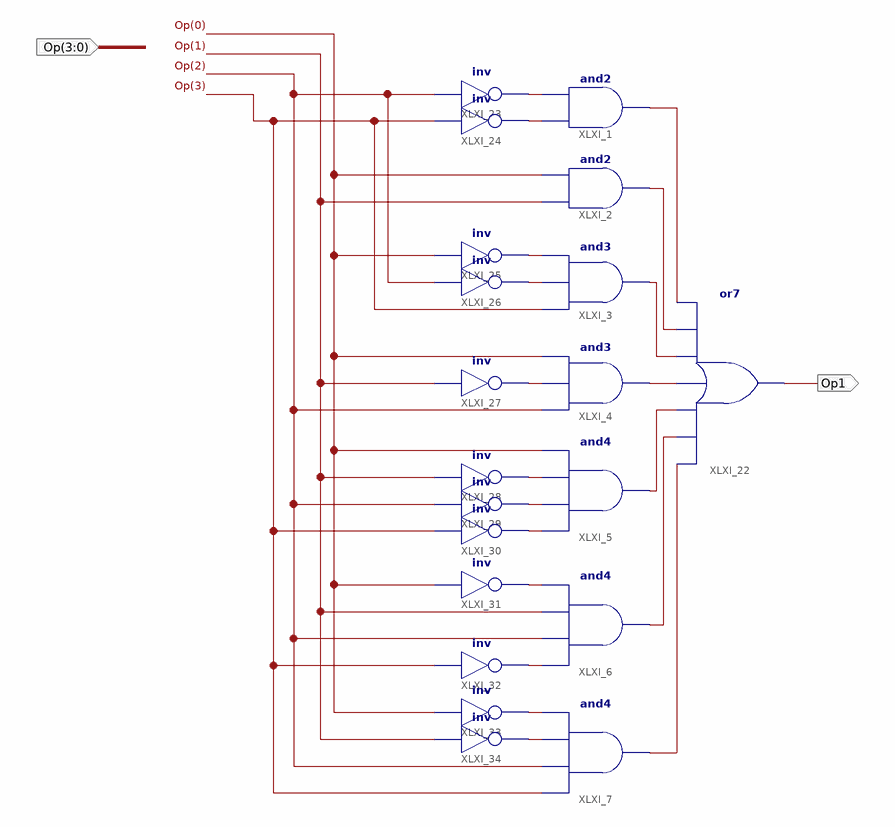
[diagram p0: schematic sheet 1]
// Xilinx ISE schematic Op1Module.sch (spartan3e) as structural Verilog: 20 symbols, 2 ports
module Op1Module (
  input  [3:0] Op,
  output Op1
);

  wire XLXN_6, XLXN_7, XLXN_8, XLXN_9, XLXN_10, XLXN_11, XLXN_12, XLXN_45, XLXN_46, XLXN_47, XLXN_48,
       XLXN_49, XLXN_50, XLXN_51, XLXN_52, XLXN_53, XLXN_54, XLXN_55, XLXN_56;

  and XLXI_1 (XLXN_6, XLXN_46, XLXN_45);
  and XLXI_2 (XLXN_7, Op[1], Op[0]);
  and XLXI_3 (XLXN_8, Op[3], XLXN_48, XLXN_47);
  and XLXI_4 (XLXN_9, Op[2], XLXN_49, Op[0]);
  and XLXI_5 (XLXN_10, XLXN_52, XLXN_51, XLXN_50, Op[0]);
  and XLXI_6 (XLXN_11, XLXN_54, Op[2], Op[1], XLXN_53);
  and XLXI_7 (XLXN_12, Op[3], Op[2], XLXN_56, XLXN_55);
  or XLXI_22 (Op1, XLXN_12, XLXN_11, XLXN_10, XLXN_9, XLXN_8, XLXN_7, XLXN_6);
  not XLXI_23 (XLXN_45, Op[2]);
  not XLXI_24 (XLXN_46, Op[3]);
  not XLXI_25 (XLXN_47, Op[0]);
  not XLXI_26 (XLXN_48, Op[2]);
  not XLXI_27 (XLXN_49, Op[1]);
  not XLXI_28 (XLXN_50, Op[1]);
  not XLXI_29 (XLXN_51, Op[2]);
  not XLXI_30 (XLXN_52, Op[3]);
  not XLXI_31 (XLXN_53, Op[0]);
  not XLXI_32 (XLXN_54, Op[3]);
  not XLXI_33 (XLXN_55, Op[0]);
  not XLXI_34 (XLXN_56, Op[1]);
endmodule
